# EAGLE design mem_base (EAGLE 5.10)
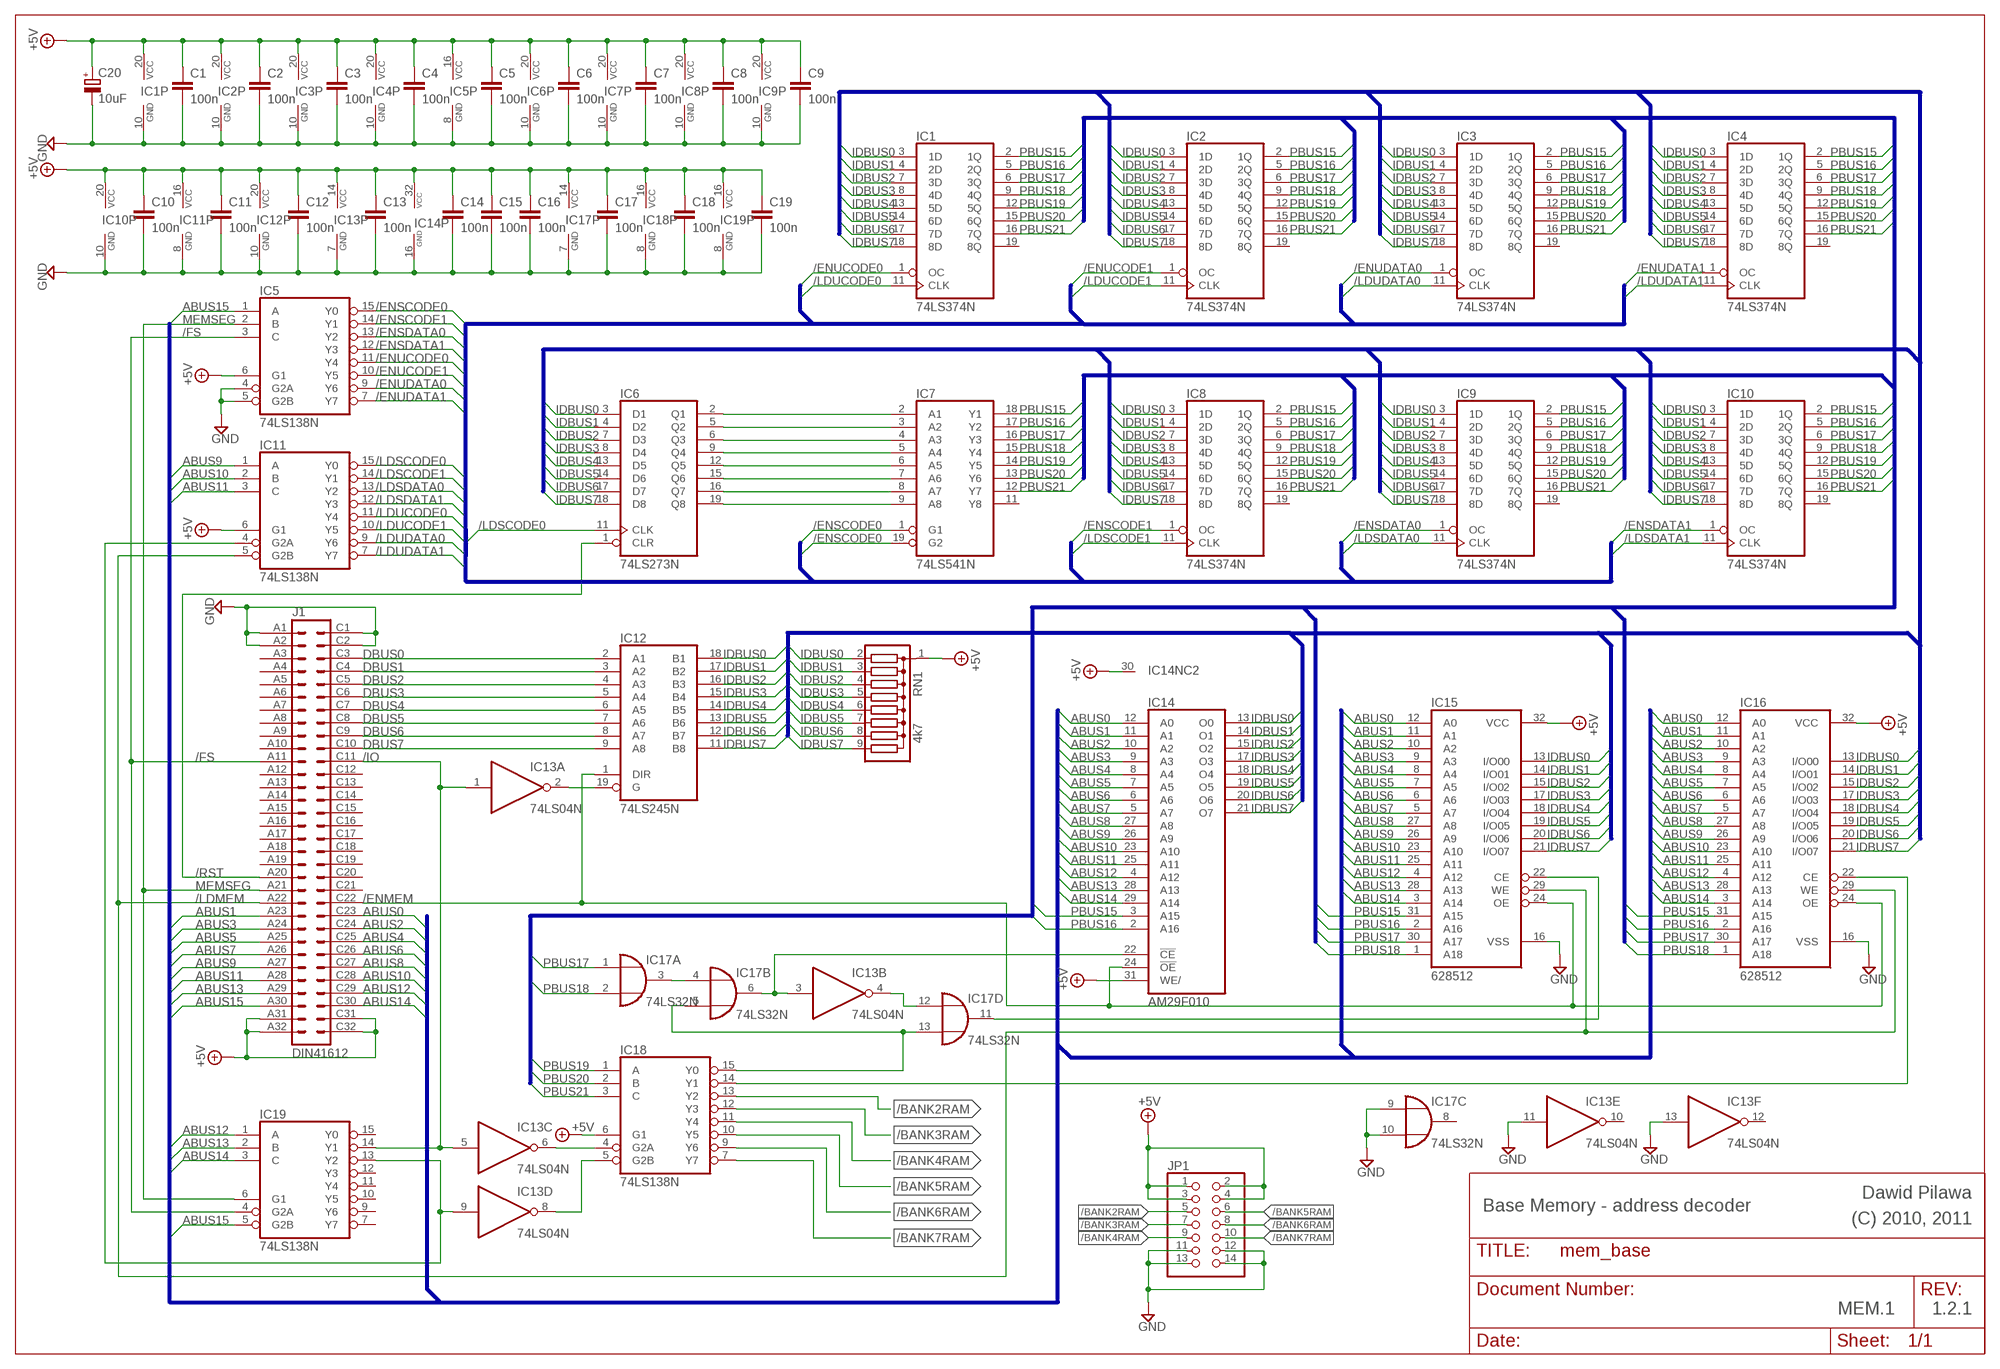
[diagram p0: schematic, sheet 1]

## Parts
C1  100n  C-EU050-025X075  [C050-025X075]
C2  100n  C-EU050-025X075  [C050-025X075]
C3  100n  C-EU050-025X075  [C050-025X075]
C4  100n  C-EU050-025X075  [C050-025X075]
C5  100n  C-EU050-025X075  [C050-025X075]
C6  100n  C-EU050-025X075  [C050-025X075]
C7  100n  C-EU050-025X075  [C050-025X075]
C8  100n  C-EU050-025X075  [C050-025X075]
C9  100n  C-EU050-025X075  [C050-025X075]
C10  100n  C-EU050-025X075  [C050-025X075]
C11  100n  C-EU050-025X075  [C050-025X075]
C12  100n  C-EU050-025X075  [C050-025X075]
C13  100n  C-EU050-025X075  [C050-025X075]
C14  100n  C-EU050-025X075  [C050-025X075]
C15  100n  C-EU050-025X075  [C050-025X075]
C16  100n  C-EU050-025X075  [C050-025X075]
C17  100n  C-EU050-025X075  [C050-025X075]
C18  100n  C-EU050-025X075  [C050-025X075]
C19  100n  C-EU050-025X075  [C050-025X075]
C20  10uF  CPOL-EUE5-4  [E5-4]
IC1  74LS374N  [DIL20]
IC2  74LS374N  [DIL20]
IC3  74LS374N  [DIL20]
IC4  74LS374N  [DIL20]
IC5  74LS138N  [DIL16]
IC6  74LS273N  74273N  [DIL20]
IC7  74LS541N  [DIL20]
IC8  74LS374N  [DIL20]
IC9  74LS374N  [DIL20]
IC10  74LS374N  [DIL20]
IC11  74LS138N  [DIL16]
IC12  74LS245N  [DIL20]
IC13  74LS04N  [DIL14]
IC14  AM29F010  [DIL32-6]
IC15  628512  HM628512A_DIL32  [DIL32]
IC16  628512  HM628512A_DIL32  [DIL32]
IC17  74LS32N  [DIL14]
IC18  74LS138N  [DIL16]
IC19  74LS138N  [DIL16]
J1  DIN41612  VG64B  [VG64B]
JP1  PINHD-2X7  [2X07]
RN1  4k7  G08R  [SIL9]

## Nets
+5V: C1.1 C2.1 C3.1 C4.1 C5.1 C6.1 C7.1 C8.1 C9.1 C10.1 C11.1 C12.1 C13.1 C14.1 C15.1 C16.1 C17.1 C18.1 C19.1 C20.+ IC1.20(VCC) IC2.20(VCC) IC3.20(VCC) IC4.20(VCC) IC5.6(G1) IC5.16(VCC) IC6.20(VCC) IC7.20(VCC) IC8.20(VCC) IC9.20(VCC) IC10.20(VCC) IC11.6(G1) IC11.16(VCC) IC12.20(VCC) IC13.14(P:VCC) IC14.30(NC) IC14.31(WE/) IC14.32(VCC) IC15.32(VCC) IC16.32(VCC) IC17.14(P:VCC) IC18.6(G1) IC18.16(VCC) IC19.16(VCC) J1.A31 J1.A32 J1.C31 J1.C32 JP1.1 JP1.2 JP1.3 JP1.4 RN1.1
/BANK0RAM: IC15.22(CE) IC17.11(D:O)
/BANK0ROM: IC13.3(B:I) IC14.22(!CE) IC17.6(B:O)
/BANK1RAM: IC16.22(CE) IC18.14(Y1)
/BANK2RAM: IC18.13(Y2) JP1.5
/BANK3RAM: IC18.12(Y3) JP1.7
/BANK4RAM: IC18.11(Y4) JP1.9
/BANK5RAM: IC18.10(Y5) JP1.6
/BANK6RAM: IC18.9(Y6) JP1.8
/BANK7RAM: IC18.7(Y7) JP1.10
/ENMEM: IC12.1(DIR) IC14.24(!OE) IC15.24(OE) IC16.24(OE) J1.C22
/ENSCODE0: IC5.15(Y0) IC7.1(G1) IC7.19(G2)
/ENSCODE1: IC5.14(Y1) IC8.1(OC)
/ENSDATA0: IC5.13(Y2) IC9.1(OC)
/ENSDATA1: IC5.12(Y3) IC10.1(OC)
/ENUCODE0: IC1.1(OC) IC5.11(Y4)
/ENUCODE1: IC2.1(OC) IC5.10(Y5)
/ENUDATA0: IC3.1(OC) IC5.9(Y6)
/ENUDATA1: IC4.1(OC) IC5.7(Y7)
/FS: IC5.3(C) IC19.4(G2A) J1.A11
/IO: IC13.1(A:I) IC13.5(C:I) IC19.14(Y1) J1.C11
/LDMEM: IC11.5(G2B) IC15.29(WE) IC16.29(WE) J1.A22
/LDSCODE0: IC6.11(CLK) IC11.15(Y0)
/LDSCODE1: IC8.11(CLK) IC11.14(Y1)
/LDSDATA0: IC9.11(CLK) IC11.13(Y2)
/LDSDATA1: IC10.11(CLK) IC11.12(Y3)
/LDUCODE0: IC1.11(CLK) IC11.11(Y4)
/LDUCODE1: IC2.11(CLK) IC11.10(Y5)
/LDUDATA0: IC3.11(CLK) IC11.9(Y6)
/LDUDATA1: IC4.11(CLK) IC11.7(Y7)
/RST: IC6.1(CLR) J1.A20
ABUS0: IC14.12(A0) IC15.12(A0) IC16.12(A0) J1.C23
ABUS1: IC14.11(A1) IC15.11(A1) IC16.11(A1) J1.A23
ABUS2: IC14.10(A2) IC15.10(A2) IC16.10(A2) J1.C24
ABUS3: IC14.9(A3) IC15.9(A3) IC16.9(A3) J1.A24
ABUS4: IC14.8(A4) IC15.8(A4) IC16.8(A4) J1.C25
ABUS5: IC14.7(A5) IC15.7(A5) IC16.7(A5) J1.A25
ABUS6: IC14.6(A6) IC15.6(A6) IC16.6(A6) J1.C26
ABUS7: IC14.5(A7) IC15.5(A7) IC16.5(A7) J1.A26
ABUS8: IC14.27(A8) IC15.27(A8) IC16.27(A8) J1.C27
ABUS9: IC11.1(A) IC14.26(A9) IC15.26(A9) IC16.26(A9) J1.A27
ABUS10: IC11.2(B) IC14.23(A10) IC15.23(A10) IC16.23(A10) J1.C28
ABUS11: IC11.3(C) IC14.25(A11) IC15.25(A11) IC16.25(A11) J1.A28
ABUS12: IC14.4(A12) IC15.4(A12) IC16.4(A12) IC19.1(A) J1.C29
ABUS13: IC14.28(A13) IC15.28(A13) IC16.28(A13) IC19.2(B) J1.A29
ABUS14: IC14.29(A14) IC15.3(A14) IC16.3(A14) IC19.3(C) J1.C30
ABUS15: IC5.1(A) IC19.5(G2B) J1.A30
DBUS0: IC12.2(A1) J1.C3
DBUS1: IC12.3(A2) J1.C4
DBUS2: IC12.4(A3) J1.C5
DBUS3: IC12.5(A4) J1.C6
DBUS4: IC12.6(A5) J1.C7
DBUS5: IC12.7(A6) J1.C8
DBUS6: IC12.8(A7) J1.C9
DBUS7: IC12.9(A8) J1.C10
GND: C1.2 C2.2 C3.2 C4.2 C5.2 C6.2 C7.2 C8.2 C9.2 C10.2 C11.2 C12.2 C13.2 C14.2 C15.2 C16.2 C17.2 C18.2 C19.2 C20.- IC1.10(GND) IC2.10(GND) IC3.10(GND) IC4.10(GND) IC5.4(G2A) IC5.5(G2B) IC5.8(GND) IC6.10(GND) IC7.10(GND) IC8.10(GND) IC9.10(GND) IC10.10(GND) IC11.8(GND) IC12.10(GND) IC13.7(P:GND) IC13.11(E:I) IC13.13(F:I) IC14.16(GND) IC15.16(VSS) IC16.16(VSS) IC17.7(P:GND) IC17.9(C:I0) IC17.10(C:I1) IC18.8(GND) IC19.8(GND) J1.A1 J1.A2 J1.C1 J1.C2 JP1.11 JP1.12 JP1.13 JP1.14
IDBUS0: IC1.3(1D) IC2.3(1D) IC3.3(1D) IC4.3(1D) IC6.3(D1) IC8.3(1D) IC9.3(1D) IC10.3(1D) IC12.18(B1) IC14.13(O0) IC15.13(I/O00) IC16.13(I/O00) RN1.2
IDBUS1: IC1.4(2D) IC2.4(2D) IC3.4(2D) IC4.4(2D) IC6.4(D2) IC8.4(2D) IC9.4(2D) IC10.4(2D) IC12.17(B2) IC14.14(O1) IC15.14(I/O01) IC16.14(I/O01) RN1.3
IDBUS2: IC1.7(3D) IC2.7(3D) IC3.7(3D) IC4.7(3D) IC6.7(D3) IC8.7(3D) IC9.7(3D) IC10.7(3D) IC12.16(B3) IC14.15(O2) IC15.15(I/O02) IC16.15(I/O02) RN1.4
IDBUS3: IC1.8(4D) IC2.8(4D) IC3.8(4D) IC4.8(4D) IC6.8(D4) IC8.8(4D) IC9.8(4D) IC10.8(4D) IC12.15(B4) IC14.17(O3) IC15.17(I/O03) IC16.17(I/O03) RN1.5
IDBUS4: IC1.13(5D) IC2.13(5D) IC3.13(5D) IC4.13(5D) IC6.13(D5) IC8.13(5D) IC9.13(5D) IC10.13(5D) IC12.14(B5) IC14.18(O4) IC15.18(I/O04) IC16.18(I/O04) RN1.6
IDBUS5: IC1.14(6D) IC2.14(6D) IC3.14(6D) IC4.14(6D) IC6.14(D6) IC8.14(6D) IC9.14(6D) IC10.14(6D) IC12.13(B6) IC14.19(O5) IC15.19(I/O05) IC16.19(I/O05) RN1.7
IDBUS6: IC1.17(7D) IC2.17(7D) IC3.17(7D) IC4.17(7D) IC6.17(D7) IC8.17(7D) IC9.17(7D) IC10.17(7D) IC12.12(B7) IC14.20(O6) IC15.20(I/O06) IC16.20(I/O06) RN1.8
IDBUS7: IC1.18(8D) IC2.18(8D) IC3.18(8D) IC4.18(8D) IC6.18(D8) IC8.18(8D) IC9.18(8D) IC10.18(8D) IC12.11(B8) IC14.21(O7) IC15.21(I/O07) IC16.21(I/O07) RN1.9
MEMSEG: IC5.2(B) IC19.6(G1) J1.A21
N$1: IC13.6(C:O) IC18.4(G2A)
N$2: IC13.4(B:O) IC17.12(D:I0)
N$3: IC13.8(D:O) IC18.5(G2B)
N$4: IC11.4(G2A) IC13.9(D:I) IC19.13(Y2)
N$5: IC6.2(Q1) IC7.2(A1)
N$6: IC6.5(Q2) IC7.3(A2)
N$7: IC6.6(Q3) IC7.4(A3)
N$8: IC6.9(Q4) IC7.5(A4)
N$9: IC17.3(A:O) IC17.4(B:I0)
N$12: IC12.19(G) IC13.2(A:O)
N$13: IC6.12(Q5) IC7.6(A5)
N$14: IC6.15(Q6) IC7.7(A6)
N$15: IC17.5(B:I1) IC17.13(D:I1) IC18.15(Y0)
N$16: IC6.16(Q7) IC7.8(A7)
N$20: IC6.19(Q8) IC7.9(A8)
PBUS15: IC1.2(1Q) IC2.2(1Q) IC3.2(1Q) IC4.2(1Q) IC7.18(Y1) IC8.2(1Q) IC9.2(1Q) IC10.2(1Q) IC14.3(A15) IC15.31(A15) IC16.31(A15)
PBUS16: IC1.5(2Q) IC2.5(2Q) IC3.5(2Q) IC4.5(2Q) IC7.17(Y2) IC8.5(2Q) IC9.5(2Q) IC10.5(2Q) IC14.2(A16) IC15.2(A16) IC16.2(A16)
PBUS17: IC1.6(3Q) IC2.6(3Q) IC3.6(3Q) IC4.6(3Q) IC7.16(Y3) IC8.6(3Q) IC9.6(3Q) IC10.6(3Q) IC15.30(A17) IC16.30(A17) IC17.1(A:I0)
PBUS18: IC1.9(4Q) IC2.9(4Q) IC3.9(4Q) IC4.9(4Q) IC7.15(Y4) IC8.9(4Q) IC9.9(4Q) IC10.9(4Q) IC15.1(A18) IC16.1(A18) IC17.2(A:I1)
PBUS19: IC1.12(5Q) IC2.12(5Q) IC3.12(5Q) IC4.12(5Q) IC7.14(Y5) IC8.12(5Q) IC9.12(5Q) IC10.12(5Q) IC18.1(A)
PBUS20: IC1.15(6Q) IC2.15(6Q) IC3.15(6Q) IC4.15(6Q) IC7.13(Y6) IC8.15(6Q) IC9.15(6Q) IC10.15(6Q) IC18.2(B)
PBUS21: IC1.16(7Q) IC2.16(7Q) IC3.16(7Q) IC4.16(7Q) IC7.12(Y7) IC8.16(7Q) IC9.16(7Q) IC10.16(7Q) IC18.3(C)
Unconnected: IC1.19(8Q) IC2.19(8Q) IC3.19(8Q) IC4.19(8Q) IC7.11(Y8) IC8.19(8Q) IC9.19(8Q) IC10.19(8Q) IC13.10(E:O) IC13.12(F:O) IC14.1(NC) IC17.8(C:O) IC19.7(Y7) IC19.9(Y6) IC19.10(Y5) IC19.11(Y4) IC19.12(Y3) IC19.15(Y0) J1.A3 J1.A4 J1.A5 J1.A6 J1.A7 J1.A8 J1.A9 J1.A10 J1.A12 J1.A13 J1.A14 J1.A15 J1.A16 J1.A17 J1.A18 J1.A19 J1.C12 J1.C13 J1.C14 J1.C15 J1.C16 J1.C17 J1.C18 J1.C19 J1.C20 J1.C21

## Buses
ABUS[0..15]
PBUS[15..21]
IDBUS[0..7]
/ENSCODE[0..1],/ENUCODE[0..1],/ENSDATA[0..1],/ENUDATA[0..1],/LDSCODE[0..1],/LDUCODE[0..1],/LDSDATA[0..1],/LDUDATA[0..1]

## Notes on the sheet
- Dawid Pilawa
- Base Memory - address decoder | (C) 2010, 2011
- MEM.1 | 1.2.1

## Library data of the parts
C1-C19 = rcl:C-EU: CAPACITOR, European symbol
C20 = rcl:CPOL-EU: POLARIZED CAPACITOR, European symbol
IC1-IC4 IC8-IC10 = 74xx-eu:74*374: Octal D type transparent LATCH, edge triggered
IC5 IC11 IC18 IC19 = 74xx-eu:74*138: 3-line to 8-line DECODER/DEMULTIPLEXER
IC6 = 74xx-eu:74*273: Octal D type FLIP FLOP, clear
IC7 = 74xx-eu:74*541: Octal BUFFER and LINE DRIVER, 3-state
IC12 = 74xx-eu:74*245: Octal BUS TRANSCEIVER, 3-state
IC13 = 74xx-eu:74*04: Hex INVERTER
IC14 = am29-memory:AM29F010*: 1-Megabit FLASH MEMORY (128 K x 8 bit) 5 V-only
IC15 IC16 = hitachi_sram_hm628512a-series_rev1:HM628512A_DIL32: 4M SRAM 512kword x 8bit
IC17 = 74xx-eu:74*32: Quad 2-input OR gate
J1 = 19inch:VG64: PCB EUROCARD, 64-pin type C/AC, 2.54 mm
JP1 = pinhead:PINHD-2X7: PIN HEADER
RN1 = resistor-sil:G08R: SIL RESISTOR

## Board
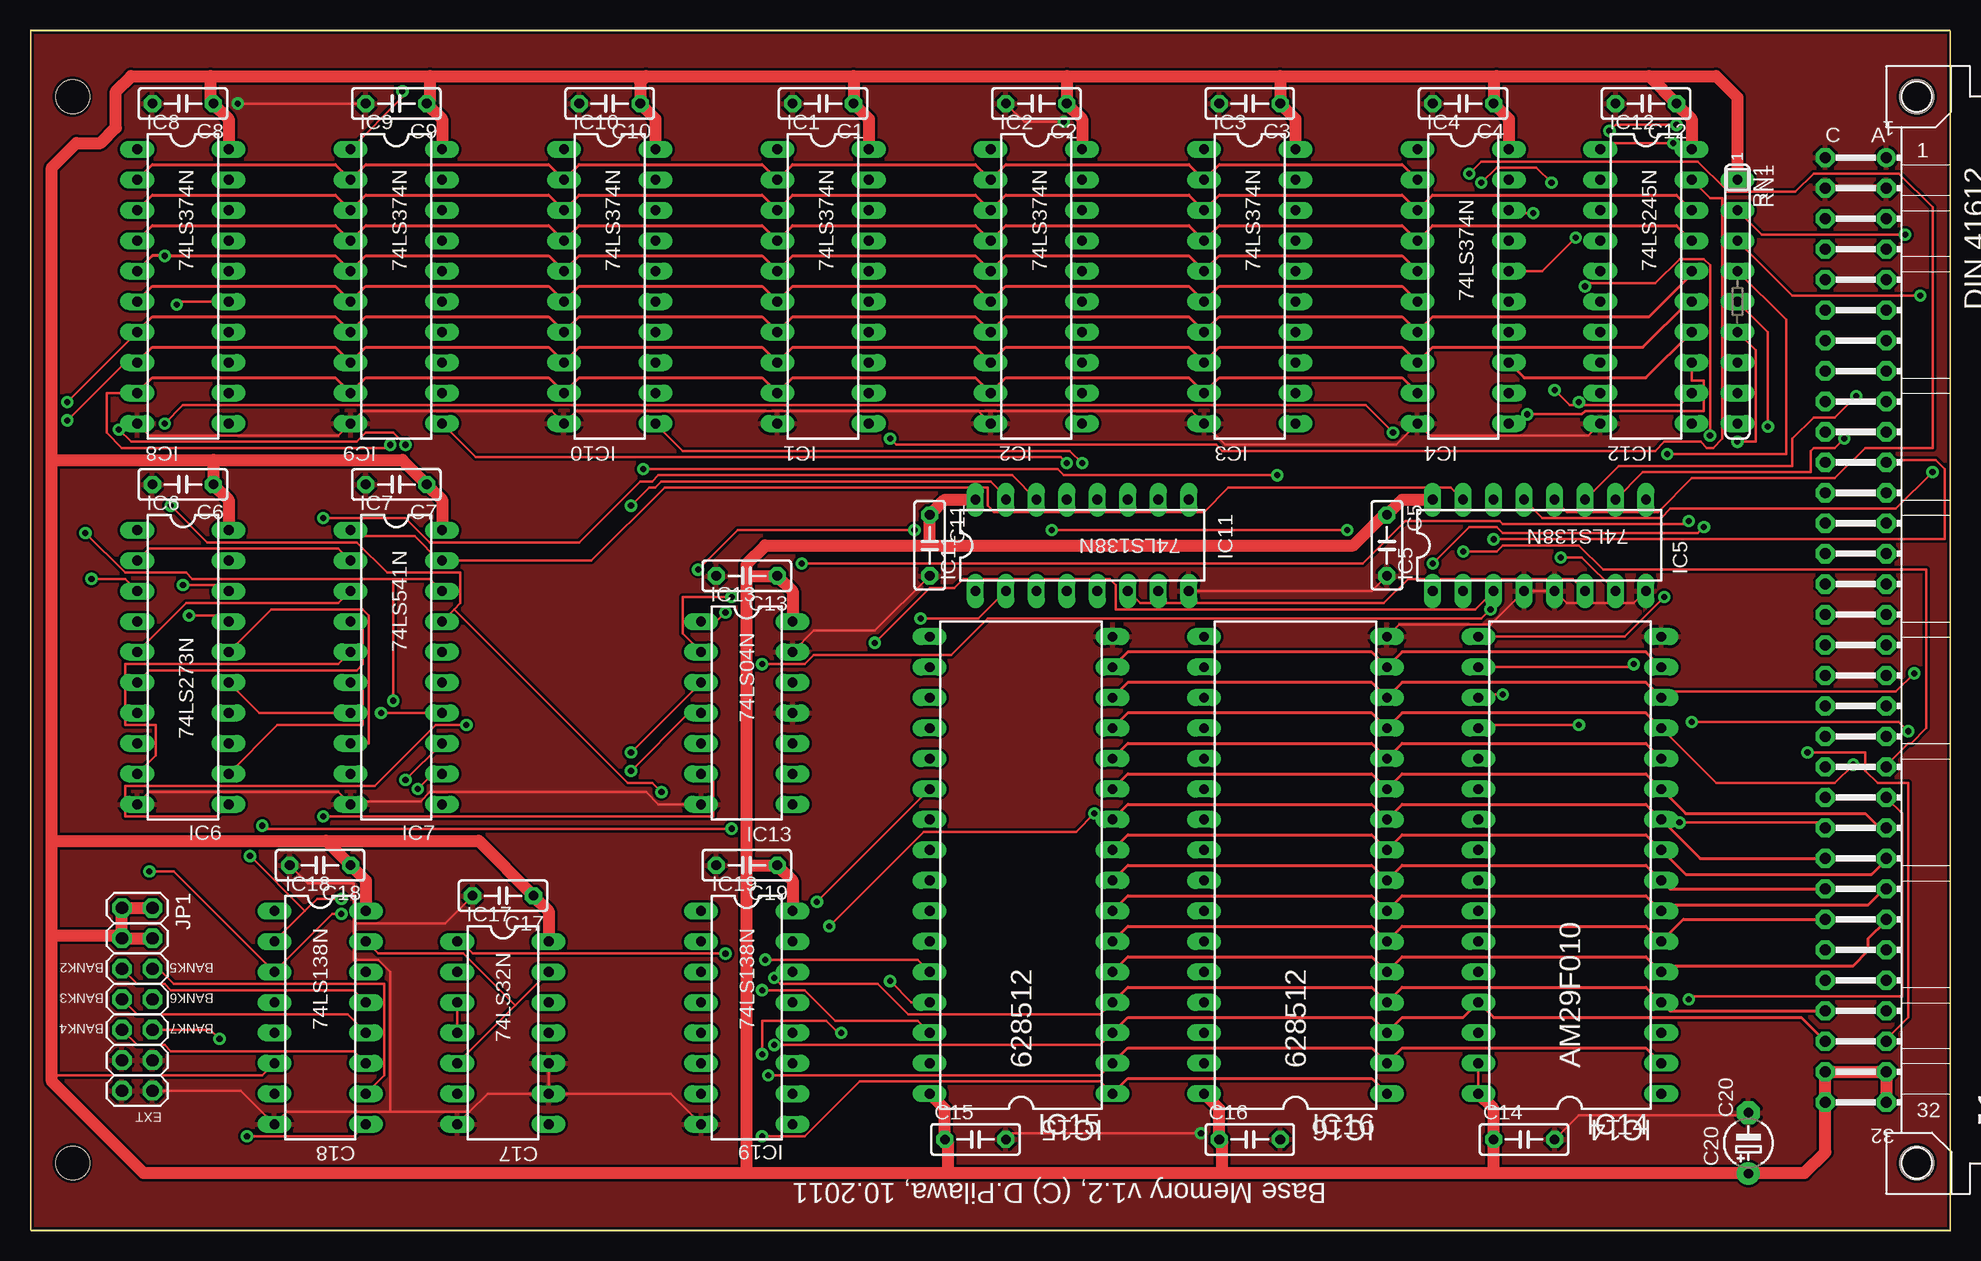
[diagram p1: board, top side]
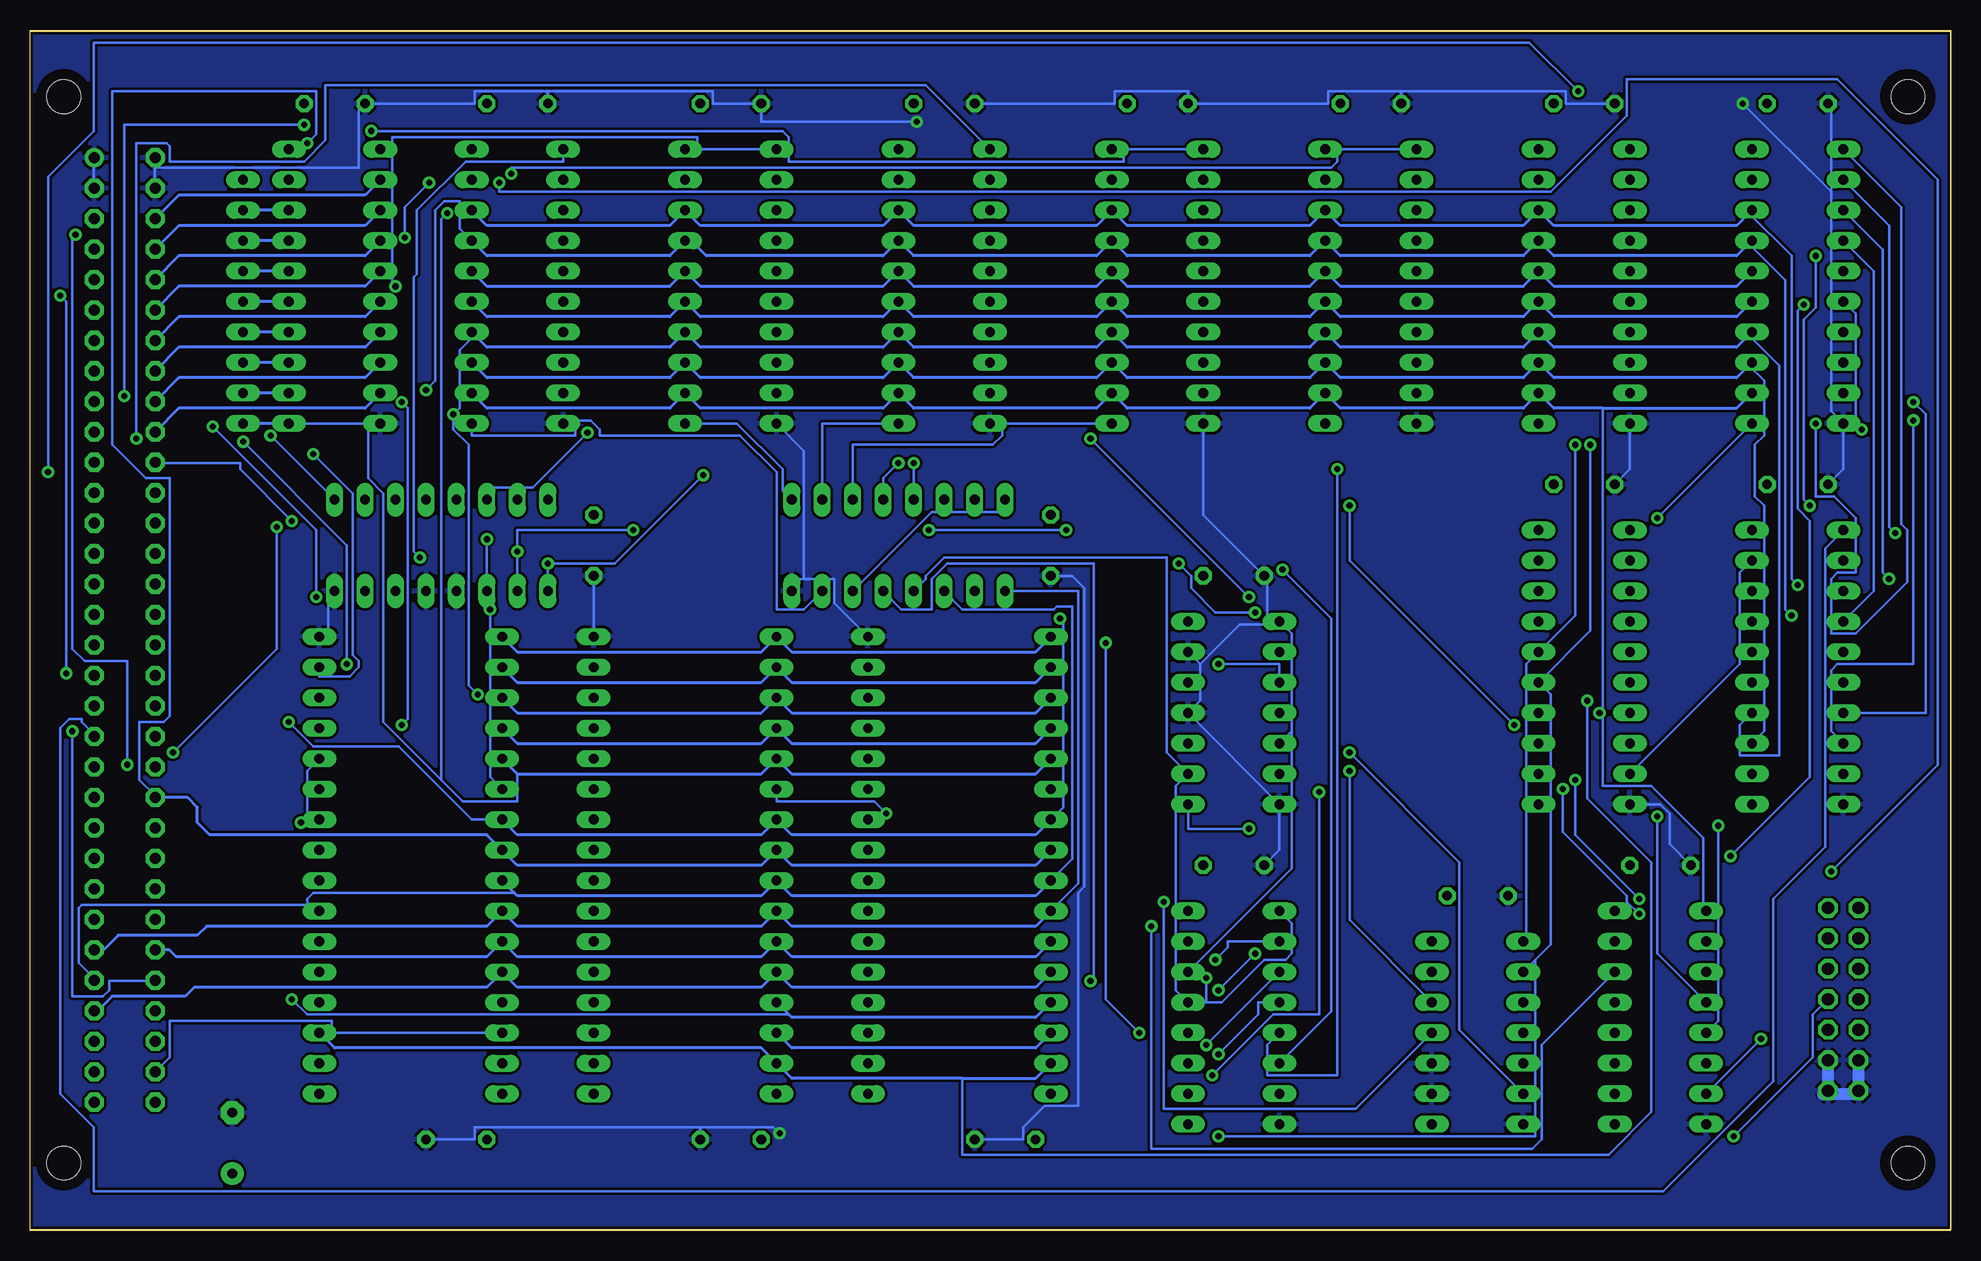
[diagram p2: board, bottom side, seen from below]

Size 160 x 100 mm. Coordinates in mm from the lower left corner, seen from the top.
Outline: 0,0 160,0 160,100 0,100 0,0
Copper layers (1*16): Top 0.035mm / dielectric 1.5mm / Bottom 0.035mm
Design rules "SparkFun_squarepads": minimum track width 8mil, minimum drill 20mil, track to track 8mil, track to pad 8mil, pad to pad 8mil, via to via 8mil, smd to smd 8mil, copper to edge 10mil, drill to drill 8mil, minimum pad ring 12mil, minimum via ring 10mil, stop-mask expansion 4mil, vias tented up to drill 25mil, thermal gap 10mil

### Footprints (pad centres in the part's own frame; a part is rotated, then mirrored left to right if it is on the bottom)
C050-025X075 = drill 0.813 octagon: 1 -2.54,0; 2 2.54,0
E5-4 = drill 0.813 pad 1.905 round: + -2.54,0 | drill 0.813 pad 1.905 octagon: - 2.54,0
DIL20 = drill 0.813 long: 1 -11.43,-3.81; 2 -8.89,-3.81; 3 -6.35,-3.81; 4 -3.81,-3.81; 5 -1.27,-3.81; 6 1.27,-3.81; 7 3.81,-3.81; 8 6.35,-3.81; 9 8.89,-3.81; 10 11.43,-3.81; 11 11.43,3.81; 12 8.89,3.81; 13 6.35,3.81; 14 3.81,3.81; 15 1.27,3.81; 16 -1.27,3.81; 17 -3.81,3.81; 18 -6.35,3.81; 19 -8.89,3.81; 20 -11.43,3.81
DIL16 = drill 0.813 long: 1 -8.89,-3.81; 2 -6.35,-3.81; 3 -3.81,-3.81; 4 -1.27,-3.81; 5 1.27,-3.81; 6 3.81,-3.81; 7 6.35,-3.81; 8 8.89,-3.81; 9 8.89,3.81; 10 6.35,3.81; 11 3.81,3.81; 12 1.27,3.81; 13 -1.27,3.81; 14 -3.81,3.81; 15 -6.35,3.81; 16 -8.89,3.81
DIL14 = drill 0.813 long: 1 -7.62,-3.81; 2 -5.08,-3.81; 3 -2.54,-3.81; 4 0,-3.81; 5 2.54,-3.81; 6 5.08,-3.81; 7 7.62,-3.81; 8 7.62,3.81; 9 5.08,3.81; 10 2.54,3.81; 11 0,3.81; 12 -2.54,3.81; 13 -5.08,3.81; 14 -7.62,3.81
DIL32-6 = drill 0.813 long: 1 -17.78,-7.62; 2 -15.24,-7.62; 3 -12.7,-7.62; 4 -10.16,-7.62; 5 -7.62,-7.62; 6 -5.08,-7.62; 7 -2.54,-7.62; 8 0,-7.62; 9 2.54,-7.62; 10 5.08,-7.62; 11 7.62,-7.62; 12 10.16,-7.62; 13 12.7,-7.62; 14 15.24,-7.62; 15 17.78,-7.62; 16 20.32,-7.62; 17 20.32,7.62; 18 17.78,7.62; 19 15.24,7.62; 20 12.7,7.62; 21 10.16,7.62; 22 7.62,7.62; 23 5.08,7.62; 24 2.54,7.62; 25 0,7.62; 26 -2.54,7.62; 27 -5.08,7.62; 28 -7.62,7.62; 29 -10.16,7.62; 30 -12.7,7.62; 31 -15.24,7.62; 32 -17.78,7.62
DIL32 = drill 0.813 long: 1 -17.78,-7.62; 2 -15.24,-7.62; 3 -12.7,-7.62; 4 -10.16,-7.62; 5 -7.62,-7.62; 6 -5.08,-7.62; 7 -2.54,-7.62; 8 0,-7.62; 9 2.54,-7.62; 10 5.08,-7.62; 11 7.62,-7.62; 12 10.16,-7.62; 13 12.7,-7.62; 14 15.24,-7.62; 15 17.78,-7.62; 16 20.32,-7.62; 17 20.32,7.62; 18 17.78,7.62; 19 15.24,7.62; 20 12.7,7.62; 21 10.16,7.62; 22 7.62,7.62; 23 5.08,7.62; 24 2.54,7.62; 25 0,7.62; 26 -2.54,7.62; 27 -5.08,7.62; 28 -7.62,7.62; 29 -10.16,7.62; 30 -12.7,7.62; 31 -15.24,7.62; 32 -17.78,7.62
VG64B = drill 0.914 pad 1.6 round: A1 154.94,39.37 | drill 0.914 pad 1.6 octagon: A2 154.94,36.83; A3 154.94,34.29; A4 154.94,31.75; A5 154.94,29.21; A6 154.94,26.67; A7 154.94,24.13; A8 154.94,21.59; A9 154.94,19.05; A10 154.94,16.51; A11 154.94,13.97; A12 154.94,11.43; A13 154.94,8.89; A14 154.94,6.35; A15 154.94,3.81; A16 154.94,1.27; A17 154.94,-1.27; A18 154.94,-3.81; A19 154.94,-6.35; A20 154.94,-8.89; A21 154.94,-11.43; A22 154.94,-13.97; A23 154.94,-16.51; A24 154.94,-19.05; A25 154.94,-21.59; A26 154.94,-24.13; A27 154.94,-26.67; A28 154.94,-29.21; A29 154.94,-31.75; A30 154.94,-34.29; A31 154.94,-36.83; A32 154.94,-39.37; C1 149.86,39.37; C2 149.86,36.83; C3 149.86,34.29; C4 149.86,31.75; C5 149.86,29.21; C6 149.86,26.67; C7 149.86,24.13; C8 149.86,21.59; C9 149.86,19.05; C10 149.86,16.51; C11 149.86,13.97; C12 149.86,11.43; C13 149.86,8.89; C14 149.86,6.35; C15 149.86,3.81; C16 149.86,1.27; C17 149.86,-1.27; C18 149.86,-3.81; C19 149.86,-6.35; C20 149.86,-8.89; C21 149.86,-11.43; C22 149.86,-13.97; C23 149.86,-16.51; C24 149.86,-19.05; C25 149.86,-21.59; C26 149.86,-24.13; C27 149.86,-26.67; C28 149.86,-29.21; C29 149.86,-31.75; C30 149.86,-34.29; C31 149.86,-36.83; C32 149.86,-39.37 | hole 2.794: 157.48,44.45; 157.48,-44.45; 3.81,-44.45; 3.81,44.45
2X07 = drill 1.016 octagon: 1 -7.62,-1.27; 2 -7.62,1.27; 3 -5.08,-1.27; 4 -5.08,1.27; 5 -2.54,-1.27; 6 -2.54,1.27; 7 0,-1.27; 8 0,1.27; 9 2.54,-1.27; 10 2.54,1.27; 11 5.08,-1.27; 12 5.08,1.27; 13 7.62,-1.27; 14 7.62,1.27
SIL9 = drill 0.813 long: 1 -10.16,0; 2 -7.62,0; 3 -5.08,0; 4 -2.54,0; 5 0,0; 6 2.54,0; 7 5.08,0; 8 7.62,0; 9 10.16,0

### Placement (x,y rotation side)
C1  66.04,93.98 180 top
C2  83.82,93.98 180 top
C3  101.6,93.98 180 top
C4  119.38,93.98 180 top
C5  113.03,57.15 270 top
C6  12.7,62.23 180 top
C7  30.48,62.23 180 top
C8  12.7,93.98 180 top
C9  30.48,93.98 180 top
C10  48.26,93.98 180 top
C11  74.93,57.15 270 top
C12  134.62,93.98 180 top
C13  59.69,54.61 180 top
C14  124.46,7.62 0 top
C15  78.74,7.62 0 top
C16  101.6,7.62 0 top
C17  39.37,27.94 180 top
C18  24.13,30.48 180 top
C19  59.69,30.48 180 top
C20  143.15,7.32 90 top
IC1  66.04,78.74 270 top
IC2  83.82,78.74 270 top
IC3  101.6,78.74 270 top
IC4  119.38,78.74 270 top
IC5  125.73,57.15 0 top
IC6  12.7,46.99 270 top
IC7  30.48,46.99 270 top
IC8  12.7,78.74 270 top
IC9  30.48,78.74 270 top
IC10  48.26,78.74 270 top
IC11  87.63,57.15 0 top
IC12  134.62,78.74 270 top
IC13  59.69,43.18 270 top
IC14  128.27,29.21 90 top
IC15  82.55,29.21 90 top
IC16  105.41,29.21 90 top
IC17  39.37,16.51 270 top
IC18  24.13,17.78 270 top
IC19  59.69,17.78 270 top
J1  -0.3,50.1 0 top
JP1  8.89,19.3 270 top
RN1  142.24,77.47 270 top

### Tracks (layer width: path | path; a pad name or v marks a point on that pad's centre or on a via)
+5V
  Top 0.203: IC18.6 19.3,12.95 1.78,12.95 | IC14.32 IC14.31 | IC5.6 128.52,54.36 114.81,54.36 112.78,52.32 92.46,52.32 IC11.6
  Top 1.016: 59.69,4.83 9.4,4.83 1.78,12.45 1.78,12.95 1.78,24.64 | 1.78,24.64 1.78,32.51 | 1.78,32.51 1.78,64.26 | 1.78,64.26 1.78,88.65 3.81,90.68 5.84,90.68 7.11,91.95 7.11,95 8.38,96.27 14.99,96.27 | 14.99,96.27 33.27,96.27 | 33.27,96.27 51.31,96.27 | 51.31,96.27 68.58,96.27 | 68.58,96.27 86.36,96.27 | 86.36,96.27 104.14,96.27 | 104.14,96.27 122.17,96.27 | 122.17,96.27 134.87,96.27 | 134.87,96.27 C12.1 138.43,92.71 IC12.20 | 51.31,96.27 50.8,95.76 C10.1 52.07,92.71 IC10.20 | 68.58,96.27 C1.1 69.85,92.71 IC1.20 | 86.36,96.27 C2.1 87.63,92.71 IC2.20 | 104.14,96.27 C3.1 105.41,92.71 IC3.20 | 122.17,96.27 121.92,96.01 C4.1 123.19,92.71 IC4.20 | RN1.1 142.24,94.49 140.46,96.27 134.87,96.27 | 7.37,24.64 JP1.3 JP1.4 | 1.78,24.64 7.37,24.64 | 7.37,24.64 7.62,24.89 JP1.1 JP1.2 | 59.69,4.83 59.69,30.73 | IC19.16 63.5,29.21 C19.1 59.94,30.48 59.69,30.73 | J1.C31 149.58,13.26 | 149.58,13.26 149.59,13.27 J1.A31 J1.A32 | 149.58,13.26 149.56,13.24 J1.C32 149.56,6.56 147.83,4.83 143.21,4.83 C20.+ 143.1,4.83 121.92,4.83 | IC11.16 76.2,60.96 C11.1 74.93,57.15 | IC13.14 63.5,53.34 C13.1 59.69,54.61 | 59.69,4.83 76.45,4.83 | 76.45,4.83 99.31,4.83 | 99.31,4.83 121.92,4.83 | 14.99,96.27 14.99,94.23 C8.1 16.51,92.71 IC8.20 | 33.27,96.27 33.27,94.23 C9.1 34.29,92.71 IC9.20 | 1.78,64.26 15.24,64.26 | 24.64,32.51 C18.1 27.94,29.21 IC18.16 | 1.78,32.51 24.64,32.51 | 24.64,32.51 37.34,32.51 C17.1 43.18,26.67 IC17.14 | 15.24,64.26 C6.1 16.51,60.96 IC6.20 | 74.93,57.15 61.21,57.15 59.69,55.63 59.69,54.61 | 59.69,30.73 59.69,54.61 | IC5.16 114.3,60.96 C5.1 112.78,59.69 110.24,57.15 74.93,57.15 | 76.45,4.83 76.45,7.37 C15.1 76.2,10.16 IC15.32
  Top 1.016: 99.31,4.83 99.31,7.37 C16.1 99.06,10.16 IC16.32 | 121.92,4.83 C14.1 121.92,10.16 IC14.32 | 15.24,64.26 30.99,64.26 C7.1 34.29,60.96 IC7.20
  Bottom 0.203: IC14.30 134.87,16.51 134.87,17.53 148.34,17.53 148.34,14.48 149.35,13.46 J1.C31 | IC11.6 84.84,59.94 78.74,59.94 IC11.16
/BANK0RAM  (via drill 0.51)
  Top 0.203: v65.53,27.43 IC15.22
  Bottom 0.203: IC17.11 49.53,10.16 65.53,10.16 v65.53,27.43
/BANK0ROM  (via drill 0.51)
  Top 0.203: v50.04,39.88 IC13.3 | v121.67,51.82 120.9,51.05 79.76,51.05 76.71,48.01 65.28,48.01 64.52,47.24 v60.96,47.24
  Bottom 0.203: IC17.6 40.89,16.76 40.89,30.73 v50.04,39.88 | IC14.22 121.67,37.85 v121.67,51.82 | v60.96,47.24 55.88,47.24 IC13.3
/BANK1RAM  (via drill 0.51)
  Top 0.203: v66.55,25.4 74.42,33.27 87.12,33.27 v88.65,34.8
  Bottom 0.203: IC18.14 34.04,15.49 34.04,7.62 34.8,6.86 66.55,6.86 v66.55,25.4 | v88.65,34.8 89.66,35.81 97.79,35.81 IC16.22
/BANK2RAM
  Top 0.203: IC18.13 26.92,20.07 11.68,20.07 11.18,20.57 8.89,20.57 JP1.5
/BANK3RAM
  Top 0.203: IC18.12 26.42,18.03 8.89,18.03 JP1.7
/BANK4RAM
  Top 0.203: IC18.11 26.92,14.99 11.68,14.99 11.18,15.49 8.89,15.49 JP1.9
/BANK5RAM
  Top 0.203: IC18.10 29.46,12.95 29.46,20.57 11.94,20.57 10.67,21.84 JP1.6
/BANK6RAM  (via drill 0.51)
  Top 0.203: IC18.9 26.92,7.87 v18.03,7.87
  Bottom 0.203: v18.03,7.87 11.43,14.48 11.43,18.03 JP1.8
/BANK7RAM  (via drill 0.51)
  Top 0.203: v15.75,16 14.99,16.76 JP1.10
  Bottom 0.203: v15.75,16 IC18.7
/ENMEM  (via drill 0.51)
  Top 0.203: IC12.1 131.32,90.68 v136.91,90.68
  Bottom 0.203: v136.91,90.68 136.14,91.44 136.14,95 153.16,95 153.16,65.53 150.37,62.74 148.34,62.74 148.34,42.93 148.84,42.42 150.88,42.42 150.88,37.59 149.61,36.32 J1.C22
  Bottom 0.254: IC15.24 76.2,30.48 96.52,30.48 IC16.24 99.06,30.48 119.38,30.48 IC14.24 121.92,33.02 145.03,33.02 146.05,34.04 146.05,35.31 146.87,36.13 J1.C22
/ENSCODE0
  Top 0.203: IC7.1 27.18,57.91 32,57.91 34.04,55.88 IC7.19 46.74,55.88 52.83,61.98 79.76,61.98 79.76,60.45 80.26,59.94 97.79,59.94 99.82,61.98 118.36,61.98 IC5.15
/ENSCODE1  (via drill 0.51)
  Top 0.203: v11.18,67.31 12.7,68.83 111.25,68.83 v113.54,66.55
  Bottom 0.203: IC8.1 4.06,85.34 4.06,58.93 3.56,58.42 3.56,54.1 7.87,49.78 9.91,49.78 9.91,54.36 9.4,54.86 7.87,54.86 7.87,59.44 9.65,61.21 11.18,61.21 v11.18,67.31 | v113.54,66.55 118.11,61.98 121.92,61.98 IC5.14
/ENSDATA0  (via drill 0.51)
  Top 0.203: IC9.1 30.99,94.49 v30.99,95 | v158.5,63.25 155.45,60.2 136.65,60.2 135.89,59.44 125.98,59.44 IC5.13
  Bottom 0.203: v30.99,95 35.05,99.06 154.69,99.06 154.69,91.69 158.5,87.88 v158.5,63.25
/ENSDATA1  (via drill 0.51)
  Top 0.203: v119.89,88.14 120.9,89.15 138.94,89.15 141.22,86.87 141.22,86.61 147.07,86.61 148.59,88.14 155.7,88.14 158.5,85.34 158.5,65.28 152.91,65.28 150.37,62.74 138.43,62.74 135.64,59.94 128.02,59.94 IC5.12
  Bottom 0.203: IC10.1 51.05,90.17 51.05,89.15 51.56,88.65 119.89,88.65 v119.89,88.14
/ENUCODE0  (via drill 0.51)
  Top 0.203: v131.57,91.69 132.08,92.2 v137.16,92.2 | v152.15,69.6 150.37,67.82 148.59,67.82 146.81,66.04 146.81,63.75 132.33,63.75 IC5.11
  Bottom 0.203: IC1.1 68.83,90.17 68.83,89.15 96.77,89.15 96.77,91.19 97.28,91.69 v131.57,91.69 | v137.16,92.2 152.15,92.2 v152.15,69.6
/ENUCODE1  (via drill 0.51)
  Top 0.203: v151.13,66.04 150.37,65.28 148.59,65.28 148.34,65.02 148.34,63.25 134.37,63.25 IC5.10
  Bottom 0.203: IC2.1 85.34,95.5 135.38,95.5 135.38,90.93 137.16,89.15 148.34,89.15 148.34,90.42 148.59,90.68 151.13,90.68 v151.13,66.04
/ENUDATA0  (via drill 0.51)
  Top 0.203: v129.54,78.74 129.79,78.99 135.38,78.99 137.41,81.03 139.45,81.03 139.95,80.52 v139.95,66.29
  Bottom 0.203: IC3.1 104.39,90.17 104.39,91.19 129.79,91.19 129.79,78.99 v129.54,78.74 | v139.95,66.29 IC5.9
/ENUDATA1  (via drill 0.51)
  Top 0.203: IC5.7 129.29,56.13 v127.51,56.13
  Bottom 0.203: v127.51,56.13 128.02,56.64 128.02,79.5 127.76,79.76 127.76,85.09 123.7,89.15 115.57,89.15 IC4.1
/FS  (via drill 0.51)
  Top 0.203: v60.96,14.73 60.96,17.53 66.29,17.53 67.31,16.51 v67.56,16.51 | v70.36,49.02 74.93,53.59 76.96,53.59 77.72,54.36 89.92,54.36 90.42,53.85 90.42,51.82 120.4,51.82 IC5.3 | v121.92,57.66 159.51,57.66 159.51,63.5 158.75,64.26 154.69,64.26 J1.A11
  Bottom 0.203: IC19.4 57.66,19.05 57.66,18.03 v60.96,14.73 | v67.56,16.51 70.36,19.3 v70.36,49.02 | IC5.3 v121.92,57.66
/IO  (via drill 0.51)
  Top 0.203: v138.18,59.18 137.92,58.93 122.68,58.93 122.43,59.18 114.55,59.18 111,55.63 v64.26,55.63 | v57.91,51.56 57.15,50.8 IC13.1
  Bottom 0.203: 54.86,41.66 IC13.5 | 54.86,41.66 54.86,49.78 IC13.1 | IC19.14 54.86,30.23 54.86,41.66 | v138.18,59.18 142.49,63.5 142.49,64.01 149.35,64.01 J1.C11 | v64.26,55.63 63.25,54.61 63.25,53.59 61.21,51.56 v57.91,51.56
/LDMEM  (via drill 0.51)
  Top 0.203: v71.63,20.83 73.41,19.05 IC15.29 | v138.18,19.3 138.43,19.56 155.96,19.56 155.96,34.8 154.69,36.07 J1.A22
  Bottom 0.203: IC11.5 87.38,51.82 84.84,51.82 84.84,54.36 83.57,55.63 71.37,55.63 71.37,21.08 v71.63,20.83 | v138.18,19.3 136.91,18.03 96.77,18.03
  Bottom 0.254: IC15.29 76.2,17.78 96.52,17.78 96.77,18.03 IC16.29
/LDSCODE0  (via drill 0.51)
  Top 0.203: IC6.11 15.49,34.54 7.87,34.54 7.87,37.08 28.7,37.08 33.78,42.16 v36.32,42.16 | v50.04,60.45 51.56,61.98 52.07,61.98 52.58,62.48 80.01,62.48 81.28,61.21 IC11.15
  Bottom 0.203: v36.32,42.16 50.04,55.88 v50.04,60.45
/LDSCODE1  (via drill 0.51)
  Top 0.203: v24.38,59.44 31.24,59.44 33.27,57.4 45.72,57.4 50.8,62.48 51.82,62.48 52.32,62.99 81.79,62.99 IC11.14
  Bottom 0.203: IC8.11 v24.38,59.44
/LDSDATA0  (via drill 0.51)
  Top 0.203: IC9.11 37.08,64.52 85.85,64.52 v86.36,64.01
  Bottom 0.203: v86.36,64.01 IC11.13
/LDSDATA1  (via drill 0.51)
  Top 0.203: IC10.11 54.36,65.02 86.61,65.02 v87.63,64.01
  Bottom 0.203: v87.63,64.01 88.9,62.74 IC11.12
/LDUCODE0
  Bottom 0.203: IC1.11 78.99,67.31 78.99,66.29 79.76,65.53 91.44,65.53 IC11.11
/LDUCODE1
  Bottom 0.203: IC2.11 93.98,67.31 IC11.10
/LDUDATA0
  Bottom 0.203: IC11.9 97.28,61.72 97.28,63.5 101.09,67.31 IC3.11
/LDUDATA1
  Bottom 0.203: IC11.7 95.5,51.82 97.79,51.82 97.79,63.25 100.84,66.29 112.52,66.29 112.52,66.8 113.28,67.56 114.55,67.56 114.55,66.29 123.19,66.29 IC4.11
/RST
  Bottom 0.203: IC6.1 10.41,56.9 10.41,32 14.73,27.69 14.73,12.45 23.88,3.3 154.69,3.3 154.69,8.64 157.48,11.43 157.48,41.91 156.72,42.67 155.7,42.67 155.7,42.42 154.69,41.4 J1.A20
ABUS0  (via drill 0.51)
  Top 0.203: v137.41,34.04 149.1,34.04 149.35,33.78 J1.C23
  Top 0.254: IC15.12 91.44,40.64 111.76,40.64 IC16.12 114.3,40.64 134.62,40.64 IC14.12
  Bottom 0.203: v137.41,34.04 136.91,34.54 136.91,38.35 IC14.12
ABUS1
  Top 0.254: IC15.11 91.44,38.1 111.76,38.1 IC16.11 114.3,38.1 134.62,38.1 IC14.11 137.92,34.8 152.91,34.8 154.12,33.59 J1.A23
ABUS2
  Top 0.254: IC15.10 91.44,35.56 111.76,35.56 IC16.10 114.3,35.56 134.62,35.56 IC14.10 139.13,31.05 J1.C24
ABUS3
  Top 0.254: IC15.9 91.44,33.02 111.76,33.02 IC16.9 114.3,33.02 134.62,33.02 IC14.9 137.92,29.72 153.42,29.72 154.64,30.94 J1.A24
ABUS4
  Top 0.254: IC15.8 91.44,30.48 111.76,30.48 IC16.8 114.3,30.48 134.62,30.48 IC14.8 136.59,28.51 J1.C25
ABUS5
  Top 0.254: IC15.7 91.44,27.94 111.76,27.94 IC16.7 114.3,27.94 134.62,27.94 IC14.7 136.4,27.18 153.16,27.18 154.49,28.51 J1.A25
ABUS6
  Top 0.254: IC15.6 91.44,25.4 111.76,25.4 IC16.6 114.3,25.4 134.62,25.4 IC14.6 137.73,25.97 J1.C26
ABUS7
  Top 0.254: IC15.5 91.44,22.86 111.76,22.86 IC16.5 114.3,22.86 134.62,22.86 IC14.5 136.4,22.1 151.89,22.1 153.16,23.37 153.16,24.38 154.64,25.86 J1.A26
ABUS8
  Bottom 0.254: IC15.27 76.2,22.86 96.52,22.86 IC16.27 99.06,22.86 119.38,22.86 IC14.27 121.92,22.86 147.83,22.86 148.4,23.43 J1.C27
ABUS9
  Bottom 0.203: IC11.1 72.64,53.34 72.64,28.96 IC15.26
  Bottom 0.254: IC15.26 76.2,25.4 96.52,25.4 IC16.26 99.06,25.4 119.38,25.4 IC14.26 121.92,25.4 145.29,25.4 146.05,24.64 152.65,24.64 153.86,23.43 J1.A27
ABUS10  (via drill 0.51)
  Top 0.203: IC11.2 78.99,51.05 v74.17,51.05 | v156.46,41.66 155.7,42.42 v138.43,42.42
  Bottom 0.203: v74.17,51.05 73.91,50.8 73.91,35.31 IC15.23 | v156.46,41.66 156.46,19.56 153.92,19.56 153.42,20.07 153.42,20.83 149.61,20.83 J1.C28 | v138.43,42.42 136.4,40.39 129.29,40.39 123.19,34.29 IC14.23
  Bottom 0.254: IC15.23 76.2,33.02 96.52,33.02 IC16.23 99.06,33.02 119.38,33.02 IC14.23
ABUS11
  Bottom 0.203: IC11.3 82.3,51.82 74.68,51.82 74.42,52.07 73.15,52.07 73.15,30.99 IC15.25 | 119.63,28.19 136.4,28.19 136.91,27.69 136.91,27.18 155.7,27.18 155.96,26.92 155.96,22.35 154.69,21.08 J1.A28
  Bottom 0.254: IC15.25 76.2,27.94 96.52,27.94 IC16.25 99.06,27.94 119.38,27.94 119.63,28.19 IC14.25
ABUS12  (via drill 0.51)
  Top 0.203: v61.98,21.08 62.48,20.57 70.61,20.57 73.15,18.03 89.15,18.03 IC15.4
  Top 0.254: IC15.4 91.44,20.32 111.76,20.32 IC16.4 114.3,20.32 134.62,20.32 IC14.4 136.59,18.35 J1.C29
  Bottom 0.203: IC19.1 54.86,25.65 54.86,23.11 55.37,22.61 57.15,22.61 60.71,19.05 61.98,19.05 v61.98,21.08
ABUS13  (via drill 0.51)
  Top 0.203: v61.21,22.61 73.91,22.61 IC15.28
  Bottom 0.203: IC19.2 60.2,24.13 60.2,23.62 v61.21,22.61
  Bottom 0.254: IC15.28 76.2,20.32 96.52,20.32 IC16.28 99.06,20.32 119.38,20.32 IC14.28 121.92,20.32 146.3,20.32 147.07,19.56 153.16,19.56 154.37,18.35 J1.A29
ABUS14  (via drill 0.51)
  Top 0.203: v61.98,15.49 89.15,15.49 IC15.3
  Top 0.254: IC15.3 91.44,17.78 111.76,17.78 IC16.3 114.3,17.78 119.38,17.78 IC14.29 121.92,17.78 147.57,17.78 149.54,15.81 J1.C30
  Bottom 0.203: IC19.3 v61.98,15.49
ABUS15  (via drill 0.51)
  Top 0.203: v51.05,63.5 85.6,63.5 86.11,62.99 v103.89,62.99 | v148.08,39.88 152.91,39.88 152.91,38.35 153.92,37.34 156.46,37.34 156.46,17.78 154.69,16 J1.A30 | v139.45,58.67 138.94,58.17 122.68,58.17 122.17,58.67 119.89,58.67 v116.84,55.63
  Bottom 0.203: IC19.5 56.9,15.49 56.9,12.95 51.05,12.95 v51.05,63.5 | v103.89,62.99 111.25,55.63 v116.84,55.63 IC5.1 | v148.08,39.88 139.45,48.51 v139.45,58.67
DBUS0
  Bottom 0.254: J1.C3 147.59,86.36 132.08,86.36 IC12.2
DBUS1
  Bottom 0.254: J1.C4 147.59,83.82 132.08,83.82 IC12.3
DBUS2
  Bottom 0.254: J1.C5 147.59,81.28 132.08,81.28 IC12.4
DBUS3
  Bottom 0.254: J1.C6 147.59,78.74 132.08,78.74 IC12.5
DBUS4
  Bottom 0.254: J1.C7 147.59,76.2 132.08,76.2 IC12.6
DBUS5
  Bottom 0.254: J1.C8 147.59,73.66 132.08,73.66 IC12.7
DBUS6
  Bottom 0.254: J1.C9 147.59,71.12 132.08,71.12 IC12.8
DBUS7
  Bottom 0.254: J1.C10 147.59,68.58 132.08,68.58 IC12.9
GND  (via drill 0.51)
  Top 0.203: J1.C2 149.61,87.12 154.43,87.12 J1.A2 | C2.2 82.8,92.46 v86.11,92.46 | C17.2 34.54,25.65 26.92,25.65 | 26.92,25.65 26.92,28.96 23.11,28.96 C18.2 | IC6.10 9.91,36.58 25.65,36.58 IC7.10 26.92,35.81 32.51,35.81 33.27,36.58 51.31,36.58 52.32,35.56 IC13.7 | JP1.14 17.53,11.68 IC18.8 21.34,9.91 29.97,9.91 | 36.58,9.91 38.1,11.43 IC17.9 | 36.58,9.91 IC17.7 | IC17.9 IC17.10 | IC19.8 53.34,11.43 IC17.9 | 29.97,9.91 36.58,9.91 | 26.92,25.65 26.92,22.61 28.96,22.61 29.97,21.59 29.97,9.91 | C14.2 129.03,9.65 143,9.65 C20.- | C15.2 81.79,8.13 v97.54,8.13 | IC5.8 133.6,52.32 128.02,52.32 IC5.5 IC5.4 121.67,50.55 114.05,50.55 IC16.16 | IC12.10 129.79,66.29 116.59,66.29 IC4.10 113.79,65.53 99.57,65.53 IC3.10 96.77,68.33 78.99,68.33 | C5.2 111.76,53.34 IC11.8 | C11.2 70.36,50.04 65.28,50.04 IC13.13 | 78.99,68.33 IC2.10 | 63.25,68.33 78.99,68.33 | IC1.10 63.25,68.33 | 63.25,68.33 45.47,68.33 IC10.10 43.43,68.33 27.69,68.33 IC9.10 25.65,66.29 9.91,66.29 IC8.10 | v17.27,93.98 C9.2
  Bottom 0.203: C9.2 32,93.98 32,95 45.72,95 | 45.72,95 C10.2 | 45.72,95 51.82,95 51.82,93.98 C1.2 63.5,95 69.6,95 69.6,93.98 C2.2 | 149.61,88.65 149.61,89.41 J1.C1 | 149.61,88.65 149.61,87.12 J1.C2 | J1.A2 154.69,87.12 154.69,89.41 J1.A1 | 116.84,95 103.12,95 103.12,93.98 C3.2 99.06,92.46 v86.11,92.46 | 116.84,95 C4.2 | 116.84,95 122.94,95 122.94,93.98 C12.2 132.59,93.47 132.59,88.65 149.61,88.65 | C18.2 23.37,32.26 23.37,34.8 24.13,35.56 IC7.10 | 10.16,11.38 JP1.14 | v97.54,8.13 98.04,8.64 104.14,8.64 | 104.14,8.64 C16.2 | C14.2 122.94,7.62 122.94,8.64 104.14,8.64 | C5.2 IC16.16 | IC5.8 135.13,52.83 135.13,50.29 IC14.16 | IC15.16 92.96,52.32 92.96,54.36 95.5,54.36 | 95.5,54.36 96.52,54.36 IC11.8 | IC3.10 95.5,65.02 95.5,54.36 | C19.2 55.88,31.75 IC13.7 IC13.11 62.48,44.2 62.48,47.24 | 62.48,47.24 IC13.13 | C6.2 8.89,63.5 IC8.10 9.91,68.33 9.91,86.61 | C8.2 9.91,93.73 9.91,86.61 | C7.2 26.67,63.5 IC9.10 | IC1.10 62.23,59.69 C13.2 56.9,54.36 56.9,50.55 59.18,50.55 62.48,47.24 | C15.2 77.22,7.62 77.22,8.64 75.44,10.41 72.64,10.41 72.64,28.19 72.14,28.7 72.14,53.59 73.15,54.61 C11.2 | 9.91,86.61 v17.27,93.98
  Bottom 1.016: JP1.12 10.16,11.79 10.57,11.38 10.16,11.38 7.92,11.38 JP1.13 JP1.11
  pour Bottom: 0,99.97 160.12,99.97 160.12,0 0,0
  pour Top: 0,99.97 160.12,99.97 160.12,0 0,0
IDBUS0  (via drill 0.51)
  Top 0.203: IC6.3 7.87,54.36 v5.08,54.36 | RN1.2 144.27,83.06 v156.21,83.06 | v151.89,38.86 150.37,37.34 140.46,37.34 IC14.13
  Top 0.254: IC8.3 10.16,86.36 25.4,86.36 IC9.3 27.94,86.36 43.18,86.36 IC10.3 45.72,86.36 60.96,86.36 IC1.3 63.5,86.36 78.74,86.36 IC2.3 81.28,86.36 96.52,86.36 IC3.3 99.06,86.36 114.3,86.36 IC4.3 116.84,86.36 137.16,86.36 IC12.18 | IC15.13 91.44,43.18 111.76,43.18 IC16.13 114.3,43.18 134.62,43.18 IC14.13
  Bottom 0.203: v5.08,54.36 5.59,54.86 5.59,81.79 IC8.3 | v156.21,83.06 156.46,82.8 156.46,48.51 155.45,47.5 151.89,47.5 v151.89,38.86
  Bottom 0.254: IC12.18 RN1.2
IDBUS1  (via drill 0.51)
  Top 0.203: RN1.3 146.81,77.98 v157.48,77.98 | v156.97,46.48 155.45,44.96 135.38,44.96
  Top 0.254: IC8.4 10.16,83.82 25.4,83.82 IC9.4 27.94,83.82 43.18,83.82 IC10.4 45.72,83.82 60.96,83.82 IC1.4 63.5,83.82 78.74,83.82 IC2.4 81.28,83.82 96.52,83.82 IC3.4 99.06,83.82 114.3,83.82 IC4.4 116.84,83.82 137.16,83.82 IC12.17 | IC15.14 91.44,45.72 111.76,45.72 IC16.14 114.3,45.72 134.62,45.72 135.38,44.96 IC14.14
  Bottom 0.203: IC6.4 6.35,53.34 6.35,80.01 IC8.4 | v157.48,77.98 156.97,77.47 v156.97,46.48
  Bottom 0.254: IC12.17 RN1.3
IDBUS2  (via drill 0.51)
  Top 0.203: v3.05,69.09 IC8.7 | RN1.4 146.3,75.95 146.3,64.77 v136.4,64.77
  Top 0.254: IC8.7 10.16,76.2 25.4,76.2 IC9.7 27.94,76.2 43.18,76.2 IC10.7 45.72,76.2 60.96,76.2 IC1.7 63.5,76.2 78.74,76.2 IC2.7 81.28,76.2 96.52,76.2 IC3.7 99.06,76.2 114.3,76.2 IC4.7 116.84,76.2 134.87,76.2 138.43,79.76 IC12.16 | IC15.15 91.44,48.26 111.76,48.26 IC16.15 114.3,48.26 134.62,48.26 IC14.15
  Bottom 0.203: IC6.7 2.03,43.18 2.03,68.07 v3.05,69.09 | v136.4,64.77 133.1,61.47 133.1,48.01 132.59,47.5 132.59,46.99 133.35,46.23 135.89,46.23 IC14.15
  Bottom 0.254: IC12.16 RN1.4
IDBUS3  (via drill 0.51)
  Top 0.203: v3.05,67.56 7.87,72.39 IC8.8 | RN1.5 144.78,74.93 v144.78,67.06 | v136.14,52.83 132.84,49.53 IC14.17
  Top 0.254: IC8.8 10.16,73.66 25.4,73.66 IC9.8 27.94,73.66 43.18,73.66 IC10.8 45.72,73.66 60.96,73.66 IC1.8 63.5,73.66 78.74,73.66 IC2.8 81.28,73.66 96.52,73.66 IC3.8 99.06,73.66 114.3,73.66 IC4.8 116.84,73.66 134.37,73.66 138.18,77.47 IC12.15
  Bottom 0.203: IC6.8 9.91,41.66 9.91,46.74 9.4,47.24 3.05,47.24 v3.05,67.56 | v144.78,67.06 136.14,58.42 v136.14,52.83
  Bottom 0.254: IC12.15 RN1.5 | IC15.17 76.2,48.26 96.52,48.26 IC16.17 99.06,48.26 119.38,48.26 IC14.17
IDBUS4  (via drill 0.51)
  Top 0.203: RN1.6 143.76,73.41 143.76,65.79 v142.24,65.79 | v133.6,47.24 133.35,46.99 IC14.18
  Top 0.254: IC4.13 124.46,71.12 134.62,71.12 IC12.14
  Bottom 0.203: IC6.13 15.49,41.66 15.49,60.45 16.26,61.21 16.26,65.53 15.49,66.29 15.49,70.87 16.76,72.14 | v142.24,65.79 133.6,57.15 v133.6,47.24
  Bottom 0.254: IC4.13 121.92,71.12 106.68,71.12 IC3.13 104.14,71.12 88.9,71.12 IC2.13 86.36,71.12 71.12,71.12 IC1.13 68.58,71.12 53.34,71.12 IC10.13 50.8,71.12 35.56,71.12 IC9.13 33.02,71.12 17.78,71.12 16.76,72.14 IC8.13 | IC12.14 RN1.6 | IC15.18 76.2,45.72 96.52,45.72 IC16.18 99.06,45.72 119.38,45.72 IC14.18
IDBUS5  (via drill 0.51)
  Top 0.203: IC12.13 138.43,70.87 139.45,70.87 139.45,68.33 129.54,68.33 129.29,68.07 v124.71,68.07 | IC14.19 120.9,44.7 v122.68,44.7
  Bottom 0.203: IC6.14 17.53,42.16 17.53,39.62 14.22,39.62 14.22,72.14 16.76,74.68 | 122.94,74.68 124.21,73.41 124.21,68.58 v124.71,68.07 124.71,66.8 123.44,65.53 123.44,45.47 v122.68,44.7
  Bottom 0.254: IC4.14 122.94,74.68 121.92,73.66 106.68,73.66 IC3.14 104.14,73.66 88.9,73.66 IC2.14 86.36,73.66 71.12,73.66 IC1.14 68.58,73.66 53.34,73.66 IC10.14 50.8,73.66 35.56,73.66 IC9.14 33.02,73.66 17.78,73.66 16.76,74.68 IC8.14 | IC12.13 RN1.7 | IC15.19 76.2,43.18 96.52,43.18 IC16.19 99.06,43.18 119.38,43.18 IC14.19
IDBUS6  (via drill 0.51)
  Top 0.203: IC6.17 16,51.31 v13.21,51.31 | IC12.12 137.41,68.83 129.03,68.83 | 129.03,68.83 128.27,68.83 v127,70.1 | IC14.20 120.9,42.16 v129.03,42.16 | 129.03,68.83 v129.03,69.09
  Bottom 0.203: v13.21,51.31 13.72,51.82 13.72,79.25 16.76,82.3 | v127,70.1 126.24,70.87 126.24,85.09 125.48,85.85 124.21,85.85 124.21,83.57 IC4.17 | v129.03,42.16 128.52,42.67 128.52,68.58 v129.03,69.09
  Bottom 0.254: IC4.17 121.92,81.28 106.68,81.28 IC3.17 104.9,82.55 103.63,81.28 88.9,81.28 IC2.17 86.36,81.28 71.12,81.28 IC1.17 68.58,81.28 53.34,81.28 IC10.17 50.8,81.28 35.56,81.28 IC9.17 33.02,81.28 17.78,81.28 16.76,82.3 IC8.17 | IC12.12 RN1.8 | IC15.20 76.2,40.64 96.52,40.64 IC16.20 99.06,40.64 119.38,40.64 IC14.20
IDBUS7  (via drill 0.51)
  Top 0.203: IC6.18 16,53.85 v12.7,53.85 | IC4.18 123.44,84.84 v125.22,84.84
  Bottom 0.203: v12.7,53.85 13.21,54.36 13.21,81.28 16.76,84.84 | IC12.11 131.83,67.31 131.83,62.74 130.56,61.47 130.56,42.42 125.73,37.59 | 125.73,37.59 123.95,35.81 119.38,35.81 119.38,38.1 | v125.22,84.84 125.73,84.33 125.73,37.59
  Bottom 0.254: IC4.18 121.92,83.82 106.68,83.82 IC3.18 104.14,83.82 88.9,83.82 IC2.18 86.36,83.82 71.12,83.82 IC1.18 68.58,83.82 53.34,83.82 IC10.18 50.8,83.82 35.56,83.82 IC9.18 33.02,83.82 17.78,83.82 16.76,84.84 IC8.18 | IC12.11 RN1.9 | IC15.21 76.2,38.1 96.52,38.1 IC16.21 99.06,38.1 119.38,38.1 IC14.21
MEMSEG  (via drill 0.51)
  Top 0.203: v55.63,55.12 58.93,58.42 v73.66,58.42 | v85.09,58.42 v109.73,58.42 | v119.38,56.64 122.17,56.64 122.68,57.15 129.03,57.15 131.06,55.12 157.99,55.12 157.99,41.91 156.72,40.64 156.46,40.64 154.69,38.86 J1.A21
  Bottom 0.203: IC19.6 51.56,18.29 51.56,51.05 v55.63,55.12 | v73.66,58.42 v85.09,58.42 | v109.73,58.42 119.38,58.42 v119.38,56.64 IC5.2
N$1  (via drill 0.51)
  Top 0.203: v24.38,34.54 56.9,34.54 56.9,38.1 IC13.6
  Bottom 0.203: IC18.4 24.38,23.11 v24.38,34.54
N$2  (via drill 0.51)
  Top 0.203: v50.04,38.35 54.86,43.18 IC13.4
  Bottom 0.203: IC17.12 50.04,25.91 v50.04,38.35
N$3  (via drill 0.51)
  Top 0.203: v19.3,33.78 19.56,33.53 v58.42,33.53
  Bottom 0.203: IC18.5 19.3,17.53 v19.3,33.78 | v58.42,33.53 63.5,33.53 IC13.8
N$4
  Bottom 0.203: IC19.13 64.52,20.07 64.52,37.08 IC13.9 65.28,39.88 65.28,56.13 83.82,56.13 85.34,54.61 85.34,54.36 IC11.4
N$5
  Top 0.203: IC6.2 9.91,56.9 25.65,56.9 IC7.2
N$6
  Top 0.203: IC6.5 12.95,52.32 25.65,52.32 IC7.3
N$7
  Top 0.203: IC6.6 9.91,46.74 27.18,46.74 27.69,47.24 27.69,50.8 IC7.4
N$8
  Top 0.203: IC6.9 10.41,39.62 10.41,42.16 7.87,42.16 7.87,47.24 25.65,47.24 IC7.5
N$9
  Top 0.203: IC17.4 IC17.3
N$12  (via drill 0.51)
  Top 0.203: IC13.2 54.36,49.78 54.36,52.83 v58.42,52.83 | v71.63,66.04 72.14,65.53 98.81,65.53 99.31,65.02 135.38,65.02 136.14,65.79 139.19,65.79 139.7,65.28 140.21,65.28 140.97,66.04 140.97,86.11 139.95,86.11 IC12.19
  Bottom 0.203: v58.42,52.83 v71.63,66.04
N$13
  Top 0.203: IC6.12 20.57,42.16 27.69,42.16 27.69,45.72 IC7.6
N$14
  Top 0.203: IC6.15 19.05,43.18 IC7.7
N$15
  Top 0.203: 40.39,18.8 IC17.13 | IC17.5 40.39,18.8 | IC18.15 28.96,23.11 36.07,23.11 40.39,18.8
N$16
  Top 0.203: IC6.16 20.07,51.82 27.69,51.82 28.19,51.31 28.19,40.64 IC7.8
N$20
  Bottom 0.203: IC7.9 17.53,47.24 17.53,54.86 IC6.19
PBUS15  (via drill 0.51)
  Top 0.203: IC7.18 33.27,54.36 30.23,54.36 | 30.23,54.36 13.46,54.36 12.95,54.86 7.87,54.86 v4.57,58.17 | v30.23,44.2 30.23,54.36
  Top 0.254: IC4.2 114.3,88.9 99.06,88.9 IC3.2 96.52,88.9 81.28,88.9 IC2.2 78.74,88.9 63.5,88.9 IC1.2 60.96,88.9 45.72,88.9 IC10.2 43.18,88.9 27.94,88.9 IC9.2 25.4,88.9 10.16,88.9 IC8.2
  Bottom 0.203: v4.57,58.17 5.08,58.67 5.08,83.82 IC8.2 | v30.23,44.2 30.23,36.07 24.89,30.73 24.89,9.91 28.45,6.35 82.3,6.35 82.3,12.7
  Bottom 0.254: IC15.31 76.2,12.7 82.3,12.7 96.52,12.7 IC16.31 99.06,15.24 134.62,15.24 IC14.3
PBUS16  (via drill 0.51)
  Top 0.203: 35.31,51.82 35.81,52.32 35.81,54.86 29.72,54.86 27.18,57.4 14.73,57.4 v11.68,60.45 | 35.31,51.82 IC7.17 | IC15.2 89.15,12.95 v61.47,12.95 | v52.58,36.58 51.82,37.34 49.78,37.34 35.31,51.82
  Top 0.254: IC4.5 114.3,81.28 99.06,81.28 IC3.5 96.52,81.28 81.28,81.28 IC2.5 78.74,81.28 63.5,81.28 IC1.5 60.96,81.28 45.72,81.28 IC10.5 43.18,81.28 27.94,81.28 IC9.5 25.4,81.28 v11.18,81.28 10.16,81.28 IC8.5 | IC15.2 91.44,15.24 111.76,15.24 IC16.2 114.3,15.24 134.62,15.24 IC14.2
  Bottom 0.203: v11.68,60.45 12.19,60.96 12.19,75.95 11.18,76.96 v11.18,81.28 | v61.47,12.95 56.39,18.03 52.58,18.03 v52.58,36.58
PBUS17  (via drill 0.51)
  Top 0.203: IC15.30 73.91,17.53 67.06,17.53 64.52,20.07 v60.96,20.07 | v57.91,23.11 36.83,23.11 35.81,24.13 IC17.1 | v31.24,65.53 30.23,66.55 27.94,66.55 27.18,65.79 8.38,65.79 v7.37,66.8
  Top 0.254: IC4.6 114.3,78.74 99.06,78.74 IC3.6 96.52,78.74 81.28,78.74 IC2.6 78.74,78.74 63.5,78.74 IC1.6 60.96,78.74 45.72,78.74 IC10.6 43.18,78.74 27.94,78.74 IC9.6 25.4,78.74 10.16,78.74 IC8.6
  Bottom 0.203: IC17.1 35.31,24.38 35.31,47.24 IC7.16 31.24,51.31 v31.24,65.53 | v57.91,23.11 v60.96,20.07 | v7.37,66.8 7.87,67.31 7.87,76.45 IC8.6
  Bottom 0.254: IC15.30 76.2,15.24 96.52,15.24 IC16.30
PBUS18  (via drill 0.51)
  Top 0.203: IC15.1 89.15,12.45 69.09,12.45 64.52,7.87 v60.96,7.87 | v29.97,65.53 29.72,65.28 7.62,65.28 6.35,66.55 6.35,69.85 IC8.9
  Top 0.254: IC4.9 114.3,71.12 99.06,71.12 IC3.9 96.52,71.12 81.28,71.12 IC2.9 78.74,71.12 63.5,71.12 IC1.9 60.96,71.12 45.72,71.12 IC10.9 43.18,71.12 27.94,71.12 IC9.9 25.4,71.12 10.16,71.12 IC8.9 | IC16.1 111.76,12.7 91.44,12.7 IC15.1
  Bottom 0.203: 34.54,22.61 33.27,23.88 33.27,44.7 IC7.15 29.97,50.04 v29.97,65.53 | 34.54,22.61 IC17.2 | v60.96,7.87 34.54,7.87 34.54,22.61
PBUS19  (via drill 0.51)
  Top 0.203: v29.21,43.18 IC7.14
  Bottom 0.203: IC18.1 20.57,26.92 20.57,32.77 24.89,37.08 28.96,37.08 28.96,43.18 | 28.96,43.18 28.96,68.58 | 28.96,43.18 v29.21,43.18
  Bottom 0.254: IC4.12 121.92,68.58 106.68,68.58 IC3.12 104.14,68.58 88.9,68.58 IC2.12 86.36,68.58 71.12,68.58 IC1.12 68.58,68.58 53.34,68.58 IC10.12 50.8,68.58 35.56,68.58 IC9.12 33.02,68.58 28.96,68.58 17.78,68.58 IC8.12
PBUS20  (via drill 0.51)
  Top 0.203: 22.86,26.67 23.88,27.69 v25.91,27.69 | IC18.2 22.86,26.67 | v31.24,37.59 IC7.13 | 22.86,26.67 v18.29,31.24 | v12.19,77.22 12.45,77.47 IC8.15
  Bottom 0.203: v25.91,27.69 31.24,33.02 v31.24,37.59 | v18.29,31.24 11.68,37.85 11.68,59.18 12.7,60.2 12.7,76.71 v12.19,77.22
  Bottom 0.254: IC4.15 121.92,76.2 106.68,76.2 IC3.15 104.14,76.2 88.9,76.2 IC2.15 86.36,76.2 71.12,76.2 IC1.15 68.58,76.2 53.34,76.2 IC10.15 50.8,76.2 35.56,76.2 IC9.15 33.02,76.2 17.78,76.2 IC8.15
PBUS21  (via drill 0.51)
  Top 0.203: v25.91,26.42 25.15,26.42 IC18.3 11.94,29.97 v9.91,29.97 | v32.26,36.83 33.53,38.1 IC7.12 | v120.9,87.38 122.17,88.65 125.48,88.65 v126.75,87.38 | v128.78,82.8 125.98,80.01 IC4.16
  Bottom 0.203: v25.91,26.42 26.92,27.43 26.92,27.94 32.26,33.27 v32.26,36.83 | v9.91,29.97 1.02,38.86 1.02,87.63 9.4,96.01 26.92,96.01 26.92,92.96 33.27,86.61 120.9,86.61 v120.9,87.38 | v126.75,87.38 128.78,85.34 v128.78,82.8
  Bottom 0.254: IC4.16 121.92,78.74 106.68,78.74 IC3.16 104.14,78.74 88.9,78.74 IC2.16 86.36,78.74 71.12,78.74 IC1.16 68.58,78.74 53.34,78.74 IC10.16 50.8,78.74 35.56,78.74 IC9.16 33.02,78.74 17.78,78.74 IC8.16

### Text on the board
_tsilk: 1 | 1 | 74LS374N | 74LS374N | 74LS374N | 74LS374N | 74LS374N | 74LS374N | 74LS245N | RN1 | 74LS374N | IC8 | IC9 | IC10 | IC1 | IC2 | IC3 | IC4 | IC12 | IC11 | 74LS138N | 74LS138N | IC5 | 74LS541N | 74LS273N | 74LS04N | IC6 | IC7 | IC13 | JP1 | 74LS138N | 74LS138N | 74LS32N | BANK2 | BANK5 | BANK3 | BANK6 | BANK4 | BANK7 | 628512 | 628512 | AM29F010 | EXT | IC15 | IC16 | IC14 | 32 | C18 | C17 | IC19 | C20 | Base Memory v1.2, (C) D.Pilawa, 10.2011